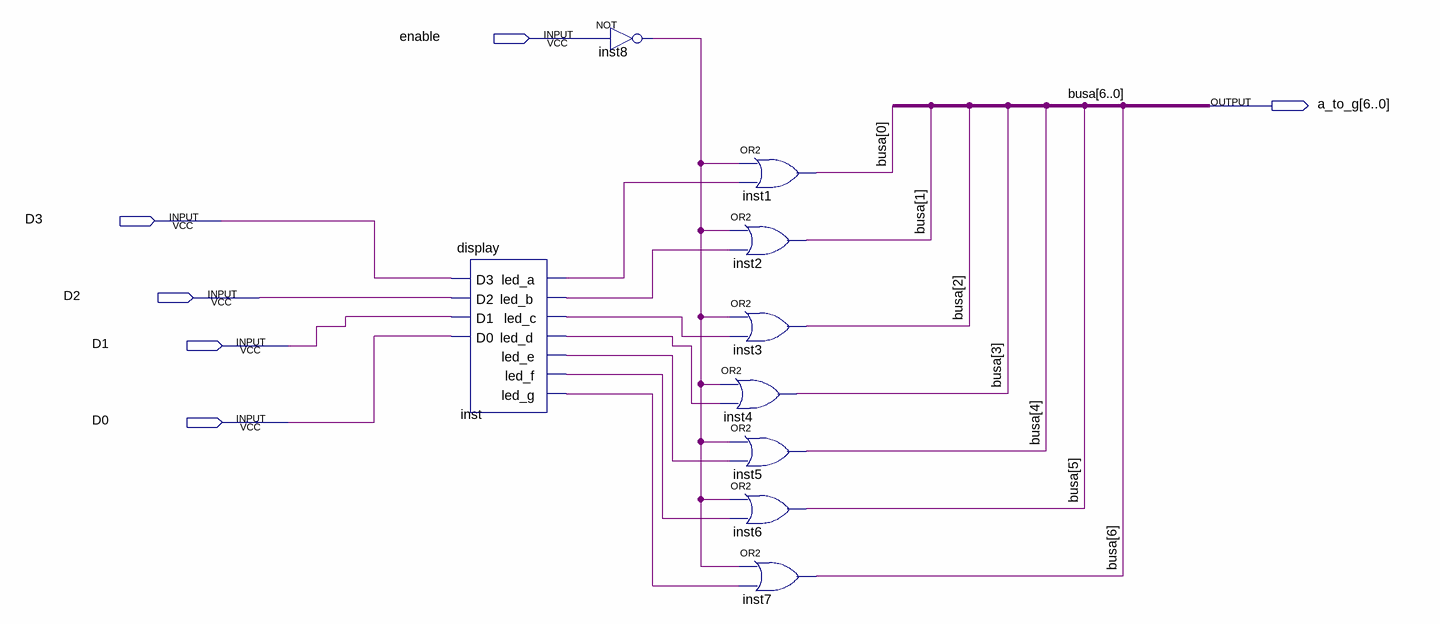
[diagram p0: schematic sheet]
// Quartus schematic displaySevenEn.bdf as structural Verilog: 9 symbols, 6 pins
module displaySevenEn (
  input  enable,
  input  D3,
  input  D2,
  input  D1,
  input  D0,
  output [6:0] a_to_g
);

  wire inst8_out, inst_led_a, inst_led_b, inst_led_c, inst_led_d, inst_led_e, inst_led_f, inst_led_g;

  display inst (
    .D3(D3), .D2(D2), .D1(D1), .D0(D0), .led_a(inst_led_a), .led_b(inst_led_b), .led_c(inst_led_c),
    .led_d(inst_led_d), .led_e(inst_led_e), .led_f(inst_led_f), .led_g(inst_led_g));
  not inst8 (inst8_out, enable);
  or inst1 (a_to_g[0], inst8_out, inst_led_a);
  or inst2 (a_to_g[1], inst8_out, inst_led_b);
  or inst3 (a_to_g[2], inst8_out, inst_led_c);
  or inst4 (a_to_g[3], inst8_out, inst_led_d);
  or inst5 (a_to_g[4], inst8_out, inst_led_e);
  or inst6 (a_to_g[5], inst8_out, inst_led_f);
  or inst7 (a_to_g[6], inst8_out, inst_led_g);

  // Other names for the same wires on the sheet: busa[6:0] = a_to_g
endmodule
